# Altium schematic sheet Master.SchDoc
size A4; PageSetup: Record=PageOptions|CenterHorizontal=True|CenterVertical=True|PrintScale=1.00|XCorrection=1.00|YCorrection=1.00|PrintKind=0|BorderSize=5000000|LeftOffset=0|BottomOffset=0|Orientation=2|PaperLength=1000|PaperWidth=1000|Scale=100|PaperSource=7|PrintQuality=-4|MediaType=1|DitherType=10|PaperKind=A4|PrintScaleMode=1
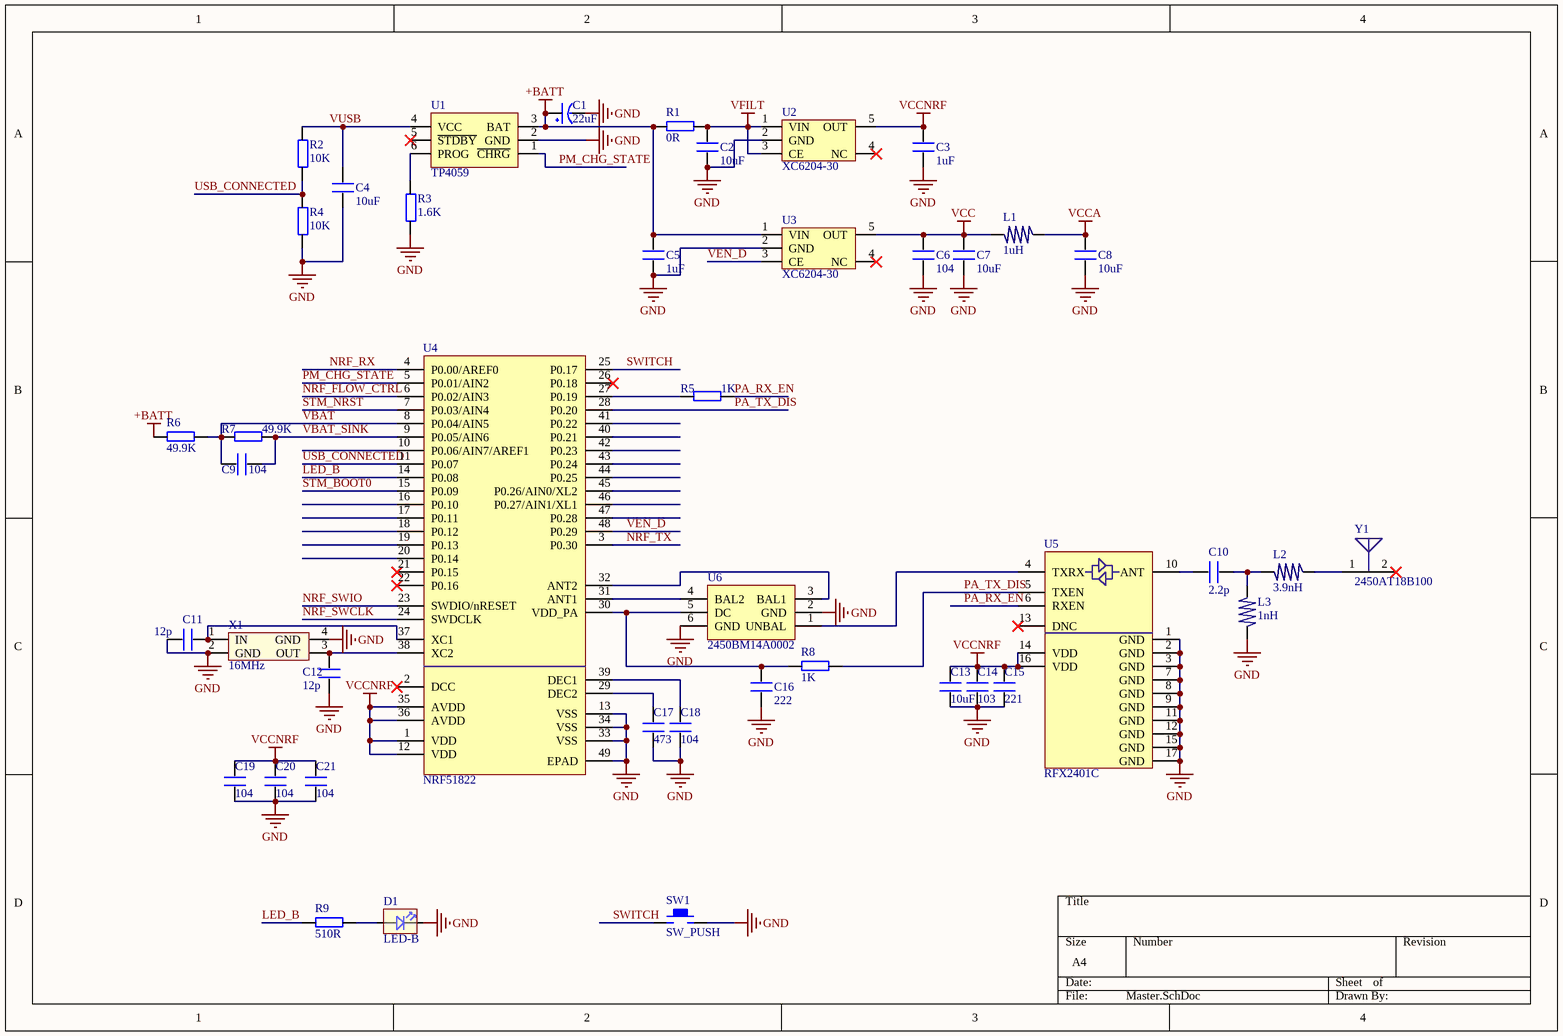
[diagram p0: Master.SchDoc]

## Parts
C1  22uF  [C0805 钽电容]
C2  10uF  [0603P]
C3  1uF  [0402]
C4  10uF  [0603P]
C5  1uF  [0402]
C6  104  [0402]
C7  10uF  [0603P]
C8  10uF  [0603P]
C9  104  [0402]
C10  2.2p  [0402]
C11  12p  [0402]
C12  12p  [0402]
C13  10uF  [0603P]
C14  103  [0402]
C15  221  [0402]
C16  222  [0402]
C17  473  [0402]
C18  104  [0402]
C19  104  [0402]
C20  104  [0402]
C21  104  [0402]
D1  LED-B  [LED1206  侧贴]
L1  1uH  [0603P]
L2  3.9nH  [0603P]
L3  1nH  [0603P]
R1  0R  [0402]
R2  10K  [0402]
R3  1.6K  [0402]
R4  10K  [0402]
R5  1K  [0402]
R6  49.9K  [0402]
R7  49.9K  [0402]
R8  1K  [0402]
R9  510R  [0402]
SW1  SW_PUSH  [KEY_2S]
U1  TP4059  [SOT23-6S]
U2  XC6204-30  [SOT23-5S]
U3  XC6204-30  [SOT23-5S]
U4  NRF51822  [QFN48M-04]
U5  RFX2401C  [QFN16M]
U6  2450BM14A0002  [0603-6]
X1  16MHz  [XTAL3225   无源]
Y1  2450AT18B100  [1206]

## Nets
+BATT: C1.1(VCC) C5.2 R1.2 R6.2 U1.3(BAT) U3.1(VIN)
GND: C1.2(GND) C2.1 C3.1 C4.1 C5.1 C6.1 C7.1 C8.1 C11.2 C12.2 C13.2 C14.2 C15.2 C16.2 C17.2 C18.2 C19.2 C20.2 C21.2 D1.1 L3.2 R3.1 R4.1 SW1.2 U1.2(GND) U2.2(GND) U3.2(GND) U4.13(VSS) U4.33(VSS) U4.34(VSS) U4.49(EPAD) U5.1(GND) U5.2(GND) U5.3(GND) U5.7(GND) U5.8(GND) U5.9(GND) U5.11(GND) U5.12(GND) U5.15(GND) U5.17(GND) U6.2(GND) U6.6(GND) X1.2(GND) X1.4(GND)
VCC: C6.2 C7.2 L1.2 U3.5(OUT)
VCCA: C8.2 L1.1
VCCNRF: C3.2 C13.1 C14.1 C15.1 C19.1 C20.1 C21.1 U2.5(OUT) U4.1(VDD) U4.12(VDD) U4.35(AVDD) U4.36(AVDD) U5.14(VDD) U5.16(VDD)
VFILT: C2.2 R1.1 U2.1(VIN) U2.3(CE)
LED_B: R9.2 U4.14(P0.08)
NRF_FLOW_CTRL: U4.6(P0.02/AIN3)
NRF_RX: U4.4(P0.00/AREF0)
NRF_SWCLK: U4.24(SWDCLK)
NRF_SWIO: U4.23(SWDIO/nRESET)
NRF_TX: U4.3(P0.30)
PA_RX_EN: R5.1 U5.6(RXEN)
PA_TX_DIS: R8.1 U4.28(P0.20) U5.5(TXEN)
PM_CHG_STATE: U1.1(~{CHRG}) U4.5(P0.01/AIN2)
STM_BOOT0: U4.15(P0.09)
STM_NRST: U4.7(P0.03/AIN4)
SWITCH: SW1.1 U4.25(P0.17)
USB_CONNECTED: R2.1 R4.2 U4.11(P0.07)
VBAT: C9.2 R6.1 R7.2 U4.8(P0.04/AIN5)
VBAT_SINK: C9.1 R7.1 U4.9(P0.05/AIN6)
VEN_D: U3.3(CE) U4.48(P0.29)
VUSB: C4.2 R2.2 U1.4(VCC)
NetC10_1: C10.1 U5.10(ANT)
NetC10_2: C10.2 L2.2 L3.1
NetC11_1: C11.1 U4.37(XC1) X1.1(IN)
NetC12_1: C12.1 U4.38(XC2) X1.3(OUT)
NetC16_1: C16.1 R8.2 U4.30(VDD_PA) U6.5(DC)
NetC17_1: C17.1 U4.29(DEC2)
NetC18_1: C18.1 U4.39(DEC1)
NetD1_3: D1.3 R9.1
NetL2_1: L2.1 Y1.1(FP)
NetR3_2: R3.2 U1.6(PROG)
NetR5_2: R5.2 U4.27(P0.19)
NetU4_31: U4.31(ANT1) U6.4(BAL2)
NetU4_32: U4.32(ANT2) U6.3(BAL1)
NetU5_4: U5.4(TXRX) U6.1(UNBAL)

Not connected (* = marked no-connect by the designer): D1 2; U1 5(~{STDBY})*; U2 4(NC)*; U3 4(NC)*; U4 2(DCC)* 10(P0.06/AIN7/AREF1) 16(P0.10) 17(P0.11) 18(P0.12) 19(P0.13) 20(P0.14) 21(P0.15)* 22(P0.16)* 26(P0.18)* 40(P0.21) 41(P0.22) 42(P0.23) 43(P0.24) 44(P0.25) 45(P0.26/AIN0/XL2) 46(P0.27/AIN1/XL1) 47(P0.28); U5 13(DNC)*; Y1 2(NC)*

## Library data of the parts
C1 = CAP
C2-C21 = C
D1 = LED 1206 侧贴  单色
L1-L3 = L
R1-R9 = R
SW1 = KEY
U2 U3 = XC6204
U6 = BALUN
X1 = XTAL-无源贴片: 无源贴片晶振
Y1 = CHIP_ANTENNA